# EAGLE design gpxtendo (EAGLE 8.3.1)
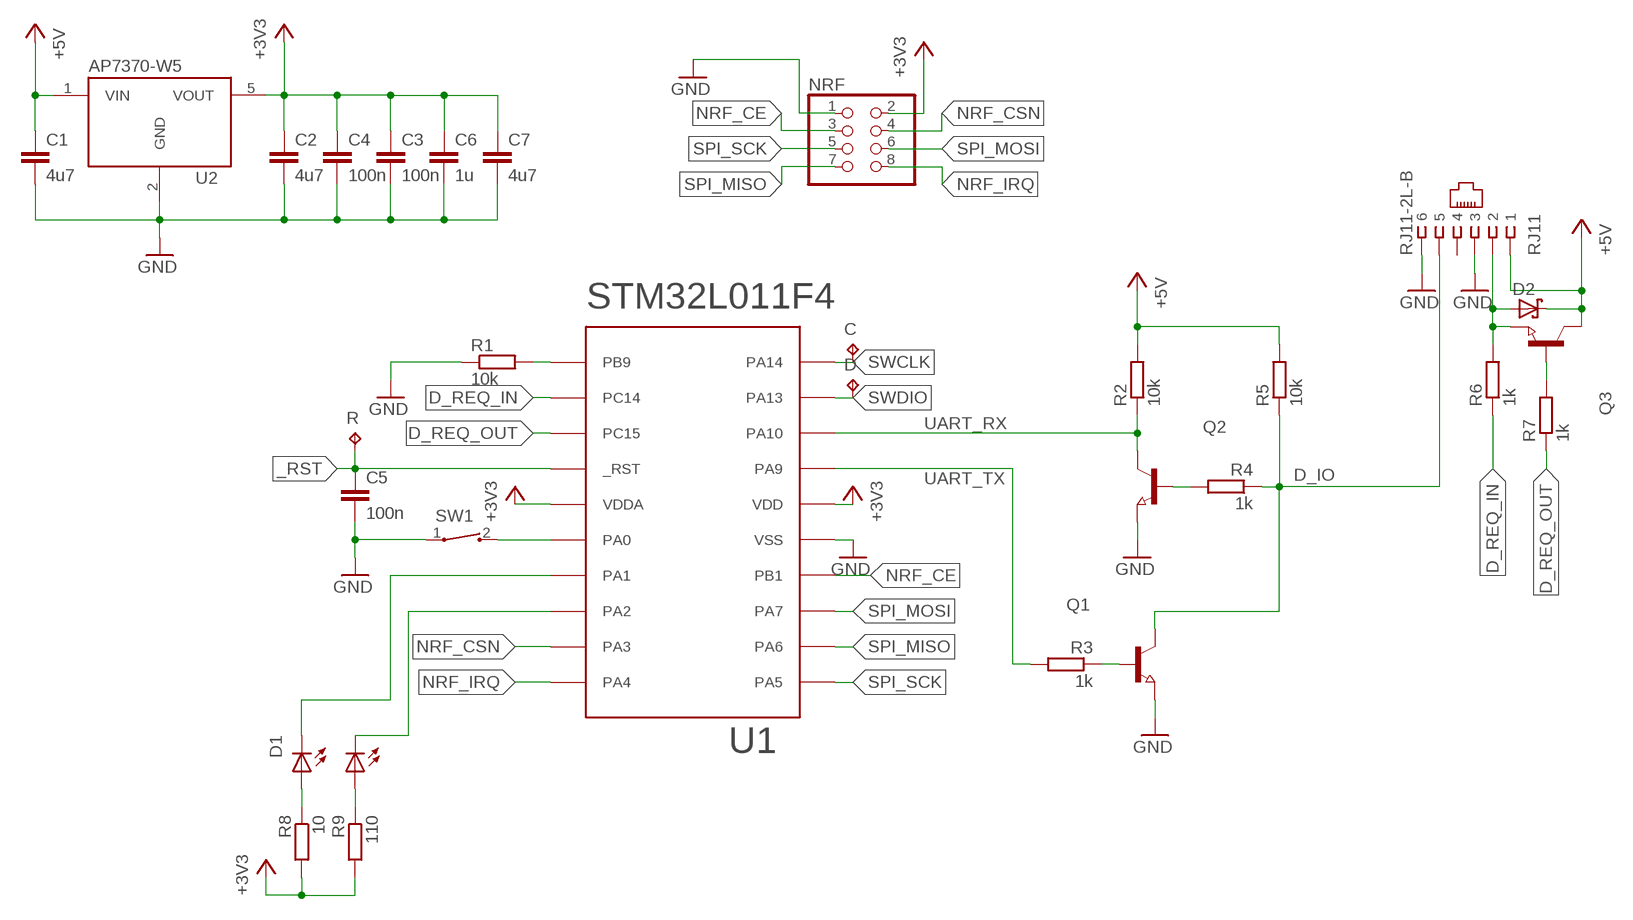
[diagram p0: schematic, sheet 1]

## Parts
C  TPTP10R  [TP10R]
C1  4u7  C0603-S  [C0603-S]
C2  4u7  C0603-S  [C0603-S]
C3  100n  C0603-S  [C0603-S]
C4  100n  C0603-S  [C0603-S]
C5  100n  C0603-S  [C0603-S]
C6  1u  C0603-S  [C0603-S]
C7  4u7  C0603-S  [C0603-S]
D  TPTP10R  [TP10R]
D1  LED-DUAL  [LED-1210]
D2  PMEG4030  [SOD123]
NRF  PINHD-2X4  [2X04]
Q1  NPN-TRANSISTOR_SOT23  [SOT23]
Q2  NPN-TRANSISTOR_SOT23  [SOT23]
Q3  NPN-TRANSISTOR_SOT23  [SOT23]
R  TPTP10R  [TP10R]
R1  10k  R0603-S  [R0603-S]
R2  10k  R0603-S  [R0603-S]
R3  1k  R0603-S  [R0603-S]
R4  1k  R0603-S  [R0603-S]
R5  10k  R0603-S  [R0603-S]
R6  1k  R0603-S  [R0603-S]
R7  1k  R0603-S  [R0603-S]
R8  10  R0603-S  [R0603-S]
R9  110  R0603-S  [R0603-S]
RJ11  RJ11-2L-B  [RJ11-NO_SHIELD]
SW1  SW-SPST  [TL3330]
U1  STM32L011F4PX  [TSSOP-20]
U2  AP7370-W5  [SOT23-5]

## Nets
+3V3: C2.1 C3.1 C4.1 C6.1 C7.1 NRF.2 R8.2 R9.2 U1.P$5(VDDA) U1.P$16(VDD) U2.5(VOUT)
+5V: C1.1 D2.C Q3.3(C) R2.2 R5.2 RJ11.1 U2.1(VIN)
_RST: C5.1 R.TP U1.P$4(_RST)
BOOT0: R1.2 U1.P$1(PB9)
D_IO: Q1.3(C) R4.1 R5.1 RJ11.5
D_REQ: D2.A Q3.2(E) R6.2 RJ11.2
D_REQ_IN: R6.1 U1.P$2(PC14)
D_REQ_OUT: R7.1 U1.P$3(PC15)
GND: C1.2 C2.2 C3.2 C4.2 C5.2 C6.2 C7.2 NRF.1 Q1.2(E) Q2.2(E) R1.1 RJ11.3 RJ11.6 SW1.1 U1.P$15(VSS) U2.2(GND)
N$1: Q1.1(B) R3.1
N$2: Q2.1(B) R4.2
N$3: D1.1(C0) U1.P$8(PA2)
N$4: D1.3(C1) U1.P$7(PA1)
N$5: Q3.1(B) R7.2
N$6: D1.2(A0) R9.1
N$7: D1.4(A1) R8.1
N$8: SW1.2 U1.P$6(PA0)
NRF_CE: NRF.3 U1.P$14(PB1)
NRF_CSN: NRF.4 U1.P$9(PA3)
NRF_IRQ: NRF.8 U1.P$10(PA4)
SPI_MISO: NRF.7 U1.P$12(PA6)
SPI_MOSI: NRF.6 U1.P$13(PA7)
SPI_SCK: NRF.5 U1.P$11(PA5)
SWCLK: C.TP U1.P$20(PA14)
SWDIO: D.TP U1.P$19(PA13)
UART_RX: Q2.3(C) R2.1 U1.P$18(PA10)
UART_TX: R3.2 U1.P$17(PA9)
Unconnected: RJ11.4

## Library data of the parts
C D R = testpad:TP: Test pad
C1-C7 = misc:C0603-S
D1 = misc:LED-DUAL
D2 = misc:PMEG4030
NRF = pinhead:PINHD-2X4: PIN HEADER
Q1-Q3 = semicon-smd-ipc:NPN-TRANSISTOR_: NPN TRANSISTOR
R1-R9 = misc:R0603-S
RJ11 = con-tycoelectronics:RJ11: CORCOM Modular RJ Jacks No Shield Source: www.tycoelectronics.com .. ENG_DS_1654001_1099_RJ_L_0507.pdf; MF: TYCO ELECTRONICS; MPN: RJ11-2L-B; OC_FARNELL: unknown; OC_NEWARK: 83F4463
SW1 = misc:SW-SPST
U1 = misc:STM32L011F4
U2 = misc:AP7370

## Board
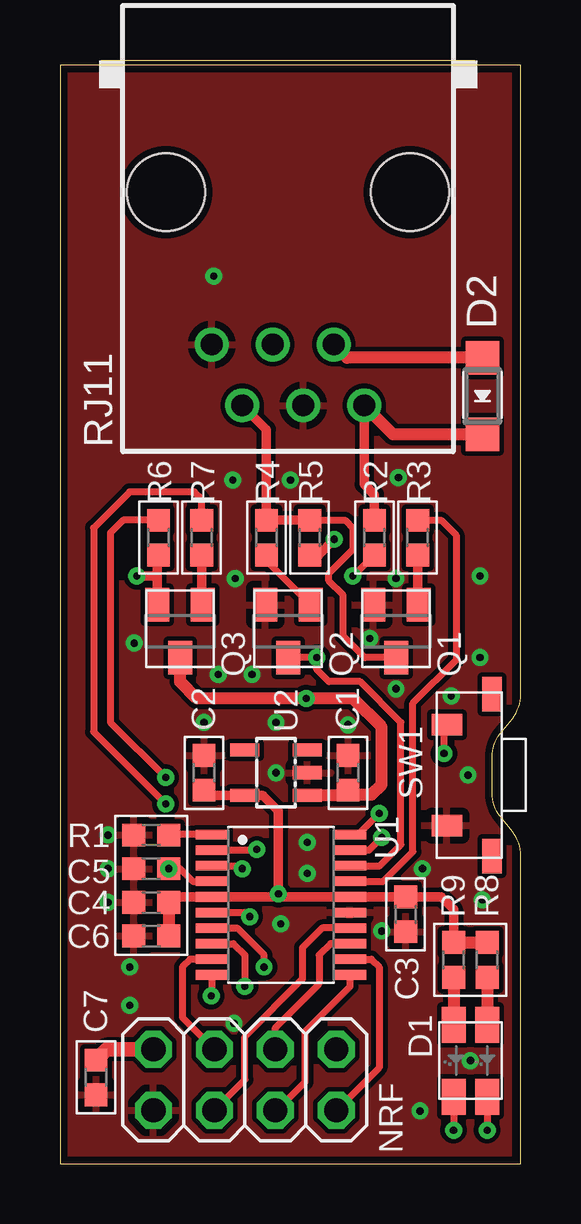
[diagram p1: board, top side]
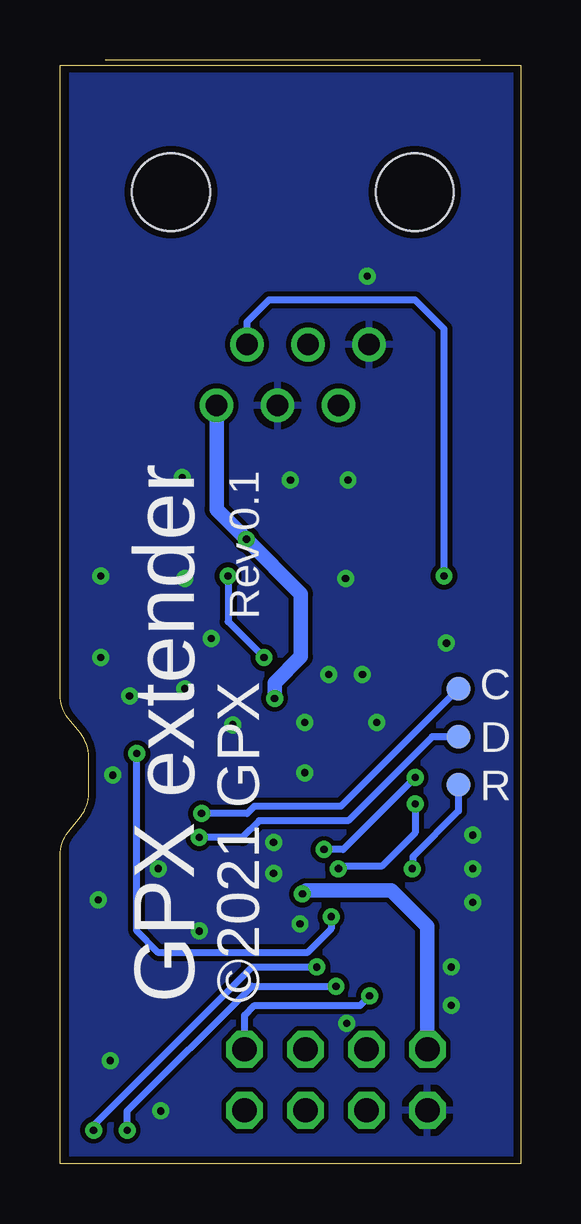
[diagram p2: board, bottom side, seen from below]

Size 19.2 x 45.8 mm. Coordinates in mm from the lower left corner, seen from the top.
Outline: 0,0 19.2,0 19.2,12.85 arc39 18.86,13.83 18.34,14.47 arc-39 18,15.45 18,16.95 arc-39 18.34,17.93 18.86,18.57 arc39 19.2,19.55 19.2,45.8 0,45.8 0,0
Copper layers (1*16): Top 0.035mm / dielectric 1.5mm / Bottom 0.035mm
Design rules "aisler": minimum track width 0.1mm, minimum drill 0.3mm, track to track 0.2mm, track to pad 0.2mm, pad to pad 0.2mm, via to via 0.2mm, smd to smd 0.1mm, copper to edge 0.3mm, drill to drill 6mil, minimum pad ring 10mil, minimum via ring 8mil, stop-mask expansion 0.1mm, vias tented up to drill 99mm, thermal gap 0.3mm

### Footprints (pad centres in the part's own frame; a part is rotated, then mirrored left to right if it is on the bottom)
TP10R = smd 1 x 1: TP 0,0
C0603-S = smd 0.95 x 0.95: 1 -0.725,0; 2 0.725,0
LED-1210 = smd 1.5 x 1: 1 -1.5,0.7; 2 1.5,0.7; 3 -1.5,-0.7; 4 1.5,-0.7
SOD123 = smd 1.4 x 1.4: A 1.6,0; C -1.6,0
2X04 = drill 1.016 octagon: 1 -3.81,-1.27; 2 -3.81,1.27; 3 -1.27,-1.27; 4 -1.27,1.27; 5 1.27,-1.27; 6 1.27,1.27; 7 3.81,-1.27; 8 3.81,1.27
SOT23 = smd 1 x 1.4: 1 -0.95,-1.1; 2 0.95,-1.1; 3 0,1.1
R0603-S = smd 0.95 x 0.95: 1 -0.725,0; 2 0.725,0
RJ11-NO_SHIELD = drill 0.9 pad 1.4: 1 -3.175,8.89; 2 -1.905,6.35; 3 -0.635,8.89; 4 0.635,6.35; 5 1.905,8.89; 6 3.175,6.35 | hole 3.251: -5.08,0; 5.08,0
TL3330 = smd 0.9 x 1.27: 1 -2.1,0.885; 2 2.1,0.885 | smd 1.45 x 0.8: CH0 3.375,-1; CH1 -3.375,-1
TSSOP-20 = smd 0.4 x 1.35: P$1 -2.925,-2.875; P$2 -2.275,-2.875; P$3 -1.625,-2.875; P$4 -0.975,-2.875; P$5 -0.325,-2.875; P$6 0.325,-2.875; P$7 0.975,-2.875; P$8 1.625,-2.875; P$9 2.275,-2.875; P$10 2.925,-2.875; P$11 2.925,2.875; P$12 2.275,2.875; P$13 1.625,2.875; P$14 0.975,2.875; P$15 0.325,2.875; P$16 -0.325,2.875; P$17 -0.975,2.875; P$18 -1.625,2.875; P$19 -2.275,2.875; P$20 -2.925,2.875
SOT23-5 = smd 0.55 x 1.2: 1 -0.95,-1.3; 2 0,-1.3; 3 0.95,-1.3; 4 0.95,1.3; 5 -0.95,1.3

### Placement (x,y rotation side)
C  2.6,19.8 0 bottom
C1  12,16.3 90 top
C2  6,16.3 90 top
C3  14.4,10.4 270 top
C4  3.8,10.9 180 top
C5  3.8,12.3 180 top
C6  3.8,9.5 180 top
C7  1.5,3.6 270 top
D  2.6,17.8 0 bottom
D1  17.1,4.3 90 top
D2  17.6,32 90 top
NRF  7.7,3.5 0 top
Q1  14,22.2 180 top
Q2  9.5,22.2 180 top
Q3  5,22.2 180 top
R  2.6,15.8 0 bottom
R1  3.8,13.7 0 top
R2  13.1,26.1 90 top
R3  14.9,26.1 90 top
R4  8.6,26.1 270 top
R5  10.4,26.1 270 top
R6  4.1,26.1 270 top
R7  5.9,26.1 270 top
R8  17.8,8.5 90 top
R9  16.4,8.5 90 top
RJ11  9.5,40.5 180 top
SW1  17,16.2 90 top
U1  9.2,10.8 270 top
U2  9,16.3 90 top

### Tracks (layer width: path | path; a pad name or v marks a point on that pad's centre or on a via)
+3V3  (via drill 0.3)
  Top 0.3: 4.65,11.12 4.65,11.03 C4.1
  Top 0.4: 4.65,11.12 U1.P$5 8.98,11.12 | C2.1 6.22,15.35 U2.5 8.45,15.35 9.1,14.7 v9.1,11.25 8.98,11.12 | 8.98,11.12 U1.P$16 C3.1 15.88,11.12 16.4,10.6 R9.2
  Top 0.5: C4.1 C6.1 | R9.2 R8.2
  Top 0.6: NRF.2 1.95,4.77 C7.1
  Bottom 0.6: NRF.2 3.89,9.89 5.4,11.4 8.95,11.4 v9.1,11.25
+5V  (via drill 0.3)
  Top 0.4: R5.2 10.78,25.38 v11.43,26.03 | RJ11.1 12.68,28.32 13.1,27.9 R2.2
  Top 0.5: U2.1 11.78,15.35 11.8,15.38 | 11.8,15.38 C1.1 | 11.8,15.38 12.97,15.38 13.4,15.8 13.4,18.2 12.2,19.4 v10.26,19.4 5.7,19.4 5,20.1 Q3.3 | D2.C 13.88,30.4 RJ11.1
  Bottom 0.6: RJ11.1 12.68,27.27 v11.43,26.03 9.16,23.76 9.16,21.14 10.26,20.04 v10.26,19.4
_RST  (via drill 0.3)
  Top 0.3: U1.P$4 5.53,11.78 5,12.3 v4.53,12.3
  Bottom 0.3: R.TP 2.6,14.7 4.5,12.8 4.5,12.32 v4.53,12.3
BOOT0
  Top 0.3: U1.P$1 4.55,13.72 R1.2
D_IO
  Top 0.3: Q1.3 12.7,21.1 11.8,22 11.8,23.7 11.2,24.3 11.2,24.6 12.2,25.6 12.2,26.5 11.88,26.82 R5.1
  Top 0.4: R5.1 R4.1 8.6,30.61 RJ11.5
D_REQ  (via drill 0.3)
  Top 0.3: 4.05,24.5
  Top 0.4: Q3.2 4.05,24.5 | v3.2,24.5 4.05,24.5 | 4.05,24.5 4.05,25.32 R6.2
  Top 0.5: D2.A 11.96,33.6 RJ11.2
  Bottom 0.3: RJ11.2 11.4,35.09 10.5,36 4.4,36 3.2,34.8 v3.2,24.5
D_REQ_IN  (via drill 0.3)
  Top 0.3: U1.P$2 8.18,13.07 v8.2,13.1 | R6.1 2.62,26.82 2.1,26.3 2.1,18.4 v4.4,16.1
  Bottom 0.3: v4.4,16.1 7.4,13.1 v8.2,13.1
D_REQ_OUT  (via drill 0.3)
  Top 0.3: U1.P$3 7.47,12.43 v7.6,12.3 | R7.1 5.9,27.7 5.6,28 2.9,28 1.4,26.5 1.4,18 v4.4,15
  Bottom 0.3: v4.4,15 4.4,13.8 5.8,12.4 7.5,12.4 v7.6,12.3
GND  (via drill 0.3)
  other vias: 9,16.3 2,13.7 2,12.3 2,10.9 2.9,8.2 2.9,6.6 6.4,37 17.5,24.5 17.5,21.1 14,19.8 12,18.3 7.3,24.4 6.6,20.4 14,24.4 12.9,21.9 9,18.4 7.2,28.5 9.6,28.5 14.1,28.6 17.1,4.3 13.4,9.7 15,2.2 17,16.2 15.1,12.3 10.3,12.1 10.3,13.4 9.2,10 7.25,5.85 17.6,11 6,18.4 8,20.4 3.1,21.7 16.3,19.5
  pour Top: 0,0 18.7,0 18.7,45.7 0,45.7
  pour Bottom: 18.7,0 0,0 0,45.7 18.7,45.7
N$1
  Top 0.3: 14.9,23.35 Q1.1
  Top 0.4: R3.1 14.9,23.35
N$2
  Top 0.3: R4.2 8.6,25.15 Q2.1
N$3  (via drill 0.3)
  Top 0.3: D1.1 v16.4,1.4 | v7.7,7.4 7.7,8.7 7.22,9.18 U1.P$8
  Bottom 0.3: v16.4,1.4 16.4,2.2 11.2,7.4 v7.7,7.4
N$4  (via drill 0.3)
  Top 0.3: D1.3 v17.8,1.4 | v8.5,8.2 8.5,8.7 7.38,9.82 U1.P$7
  Bottom 0.3: v17.8,1.4 17.8,1.6 11.2,8.2 v8.5,8.2
N$5
  Top 0.3: 5.9,23.35 Q3.1
  Top 0.4: R7.2 5.9,23.35
N$6
  Top 0.5: R9.1 D1.2
N$7
  Top 0.5: R8.1 D1.4
N$8  (via drill 0.3)
  Top 0.3: U1.P$6 7.72,10.47 v7.9,10.3 | v16,17.1 16,18.18 SW1.2
  Bottom 0.3: v7.9,10.3 7.9,9.8 8.9,8.8 15.1,8.8 16,9.7 v16,17.1
NRF_CE
  Top 0.3: NRF.3 7.7,3.5 7.7,5.3 10.1,7.7 10.1,9 10.93,9.82 U1.P$14
NRF_CSN
  Top 0.3: NRF.4 5.1,6.1 5.1,8.2 5.42,8.53 U1.P$9
NRF_IRQ  (via drill 0.3)
  Top 0.3: U1.P$10 6.33,7.03 v6.3,7
  Bottom 0.3: NRF.8 11.51,6.19 11.1,6.6 6.7,6.6 v6.3,7
SPI_MISO
  Top 0.3: NRF.7 11.53,2.23 13.3,4 13.3,8.2 12.97,8.53 U1.P$12
SPI_MOSI
  Top 0.3: NRF.6 8.97,5.67 10.8,7.5 10.8,8.7 11.28,9.18 U1.P$13
SPI_SCK
  Top 0.3: NRF.5 9.03,2.23 10.2,3.4 10.2,5.5 12.07,7.38 U1.P$11
SWCLK  (via drill 0.3)
  Top 0.3: U1.P$20 12.43,13.72 v13.3,14.6
  Bottom 0.3: C.TP 7.5,14.9 11.1,14.9 11.4,14.6 v13.3,14.6
SWDIO  (via drill 0.3)
  Top 0.3: U1.P$19 12.88,13.07 v13.4,13.6
  Bottom 0.3: D.TP 3.7,17.8 7.2,14.3 10.9,14.3 11.6,13.6 v13.4,13.6
UART_RX  (via drill 0.3)
  Top 0.3: 13.07,25.38 R2.1 12.22,24.5 v12.2,24.5 | 10.68,21.1 v10.7,21.1 | 10.68,21.1 Q2.3 | U1.P$18 13.32,12.43 14.2,13.3 14.2,18.4 12.5,20.1 11.2,20.1 10.7,20.6 10.7,21.08 10.68,21.1
  Bottom 0.3: v12.2,24.5 12.2,22.6 v10.7,21.1
UART_TX
  Top 0.3: R3.2 15.88,26.82 16.5,26.2 16.5,21 14.7,19.2 14.7,13 13.47,11.78 U1.P$17

### Text on the board
bPlace: Rev 0.1 | ©2021 GPX | GPX extender